# EasyEDA Pro project ProPrj_TTL2485_2025-05-29.epro

# Schematic Schematic1
Board Name: Board1; Create Date: 2025-05-03; Page Name: P1; Project Name: TTL2485; Schematic Name: Schematic1; Update Date: 2025-05-15; Company: 嘉立创EDA; Page Size: A4; Version: V1.0
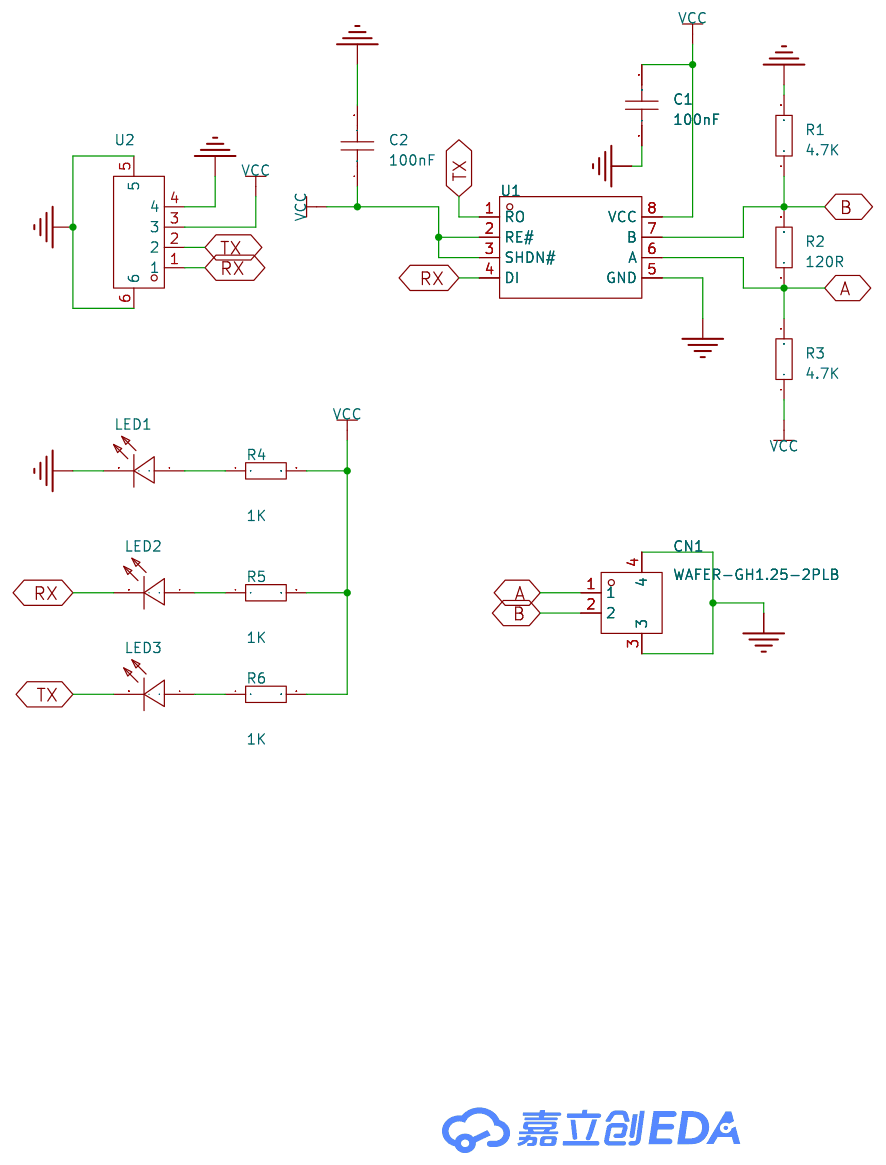
[diagram p0: schematic sheet]

## Parts
C1  100nF  [C0402]
C2  100nF  [C0402]
CN1  WAFER-GH1.25-2PLB  [CONN-TH_2P-P1.25_XUNPU_WAFER-GH1.25-2PLB]
LED1  PWR  [LED0603-R-RD]
LED2  RX  [LED0603-R-RD]
LED3  TX  [LED0603-R-RD]
R1  4.7K  [R0402]
R2  120R  [R0402]
R3  4.7K  [R0402]
R4  1K  [R0402]
R5  1K  [R0402]
R6  1K  [R0402]
U1  COS13488EESA  [SOP-8_L4.9-W3.9-P1.27-LS6.0-BL]
U2  WAFER-GH1.25-4PLB  [CONN-SMD_4P-P1.25_XUNPU_WAFER-GH1.25-4PLB]

## Library data of the parts
C1 C2 = CAP_0402: Supplier Footprint: 0402
CN1 = WAFER-GH1.25-2PLB: 插针结构:1x2P;间距:1.25mm;安装方式:立贴;参考系列:GH;总PIN数:2P;排数:1;每排PIN数:2;行距:-;额定电流:1A;触头材质:黄铜;触头镀层:-;工作温度:-25℃~+85℃;; LCSC Part Name: 1x2P 间距:1.25mm 立贴 系列:GH; Supplier Part: C3029368; Manufacturer: XUNPU(讯普); Supplier Footprint: SMD,P=1.25mm; JLCPCB Part Class: 扩展库; Datasheet: https://atta.szlcsc.com/upload/public/pdf/source/20220527/44F824AAC8C2B617205E15955FF9C23D.pdf; Supplier: LCSC; Pins Structure: 1x2P; Pitch: 1.25mm; Mounting Type: 立贴; Reference Series: GH; Number of Pins: 2P; Number of Rows: 1; Number of PINs Per Row: 2; Current Rating: 1A; Contact Material: 黄铜; Operating Temperature: -25℃~+85℃; Voltage Rating: 125V; Plastic Material: LCP; Supplementary Features: 辅助焊脚; Color: 米色; Z-Height of the Board: 4.2mm; X-Length of Bottom Edge on Board (Spacing Line): 5.75mm; Y-Width of Bottom Edge on Board: 4.95mm
LED1-LED3 = SZYY0603R: 发光颜色:红色;功率:40mW;正向电流:20mA;主波长:615nm~630nm;二极管配置:-;透镜颜色:无色透明透镜;色温:-;发光角度:120°;载带方式:-;工作温度:-40℃~+85℃;; LCSC Part Name: 红灯; Supplier Part: C434419; Manufacturer: yongyu(永裕光电); Supplier Footprint: 0603; JLCPCB Part Class: 扩展库; Datasheet: https://atta.szlcsc.com/upload/public/pdf/source/20191204/C434419_0B955C1F73FF88449D9A795B6FF49070.pdf; Supplier: LCSC; Emitted Color: 红色; Power Dissipation: 40mW; Forward Current: 20mA; Dominant Wavelength: 615nm~630nm; Peak Wavelength: 645nm; Lens Color: 无色透明透镜; Viewing Angle: 120°; Operating Temperature: -40℃~+85℃
R1-R6 = Res_0402: Supplier Footprint: 0402
U1 = COS13488EESA: 具有自动方向控制,省去隔离控制通道，16Mbps，RS-485/RS-422 半双工收发器; Supplier Part: C42381442; Manufacturer: COSINE(科山芯创); Supplier Footprint: SOP-8; Datasheet: https://atta.szlcsc.com/upload/public/pdf/source/20240710/2D3062658F0EC8CDE4998249F9B81B27.pdf; Supplier: LCSC
U2 = WAFER-GH1.25-4PLB: 插针结构:1x4P;间距:1.25mm;安装方式:立贴;参考系列:GH;总PIN数:4P;排数:1;每排PIN数:4;行距:-;额定电流:1A;触头材质:黄铜;触头镀层:-;工作温度范围:-25℃~+85℃;; LCSC Part Name: 1x4P 间距:1.25mm 立贴 系列:GH; Supplier Part: C3029370; Manufacturer: XUNPU(讯普); Supplier Footprint: SMD,P=1.25mm; JLCPCB Part Class: 扩展库; Datasheet: https://atta.szlcsc.com/upload/public/pdf/source/20220527/44F824AAC8C2B617205E15955FF9C23D.pdf; Supplier: LCSC; Pins Structure: 1x4P; Pitch: 1.25mm; Mounting Type: 立贴; Reference Series: GH; Number of Pins: 4P; Number of Rows: 1; Number of PINs Per Row: 4; Current Rating: 1A; Contact Material: 黄铜; Operating Temperature: -25℃~+85℃; Voltage Rating: 125V; Plastic Material: LCP; Supplementary Features: 辅助焊脚; Color: 米色; Z-Height of the Board: 4.2mm; X-Length of Bottom Edge on Board (Spacing Line): 8.25mm; Y-Width of Bottom Edge on Board: 4.95mm

## Nets
GND: C1.1 C2.2 CN1.3 CN1.4 LED1.2(-) R1.2 U1.5(GND) U2.4 U2.5 U2.6
VCC: C1.2 C2.1 R3.1 R4.2 R5.2 R6.2 U1.2(RE#) U1.3(SHDN#) U1.8(VCC) U2.3
A: CN1.1 R2.1 R3.2 U1.6(A)
B: CN1.2 R1.1 R2.2 U1.7(B)
RX: LED2.2(-) U1.4(DI) U2.1
TX: LED3.2(-) U1.1(RO) U2.2
$1N1480: LED1.1(+) R4.1
$1N1639: LED2.1(+) R5.1
$1N1644: LED3.1(+) R6.1

# Board PCB1
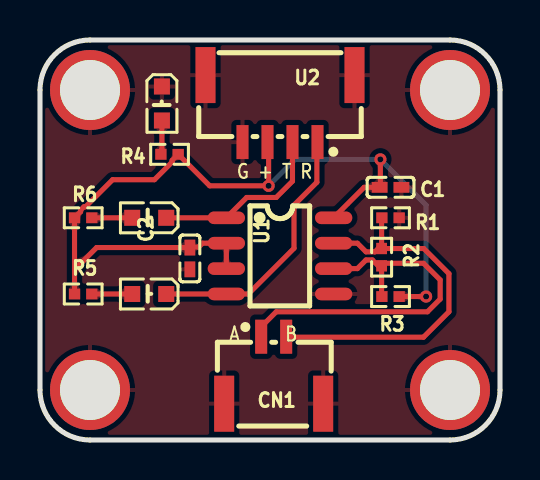
[diagram p1: board, top side]
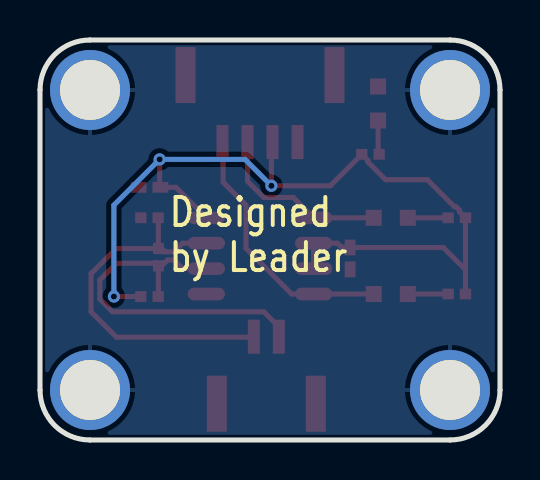
[diagram p2: board, bottom side, seen from below]

Outline 23 x 20 mm; copper layers: Top Layer, Bottom Layer. Coordinates in mm from the lower left corner of the outline.
Outline path: 0,17.5 0,2.5 arc(0.73,0.73) 2.5,0 20.5,0 arc(22.27,0.73) 23,2.5 23,17.5 arc(22.27,19.27) 20.5,20 2.5,20 arc(0.73,19.27) 0,17.5
Stack: Top Layer 0.035mm / Dielectric1 1.51mm FR4 er 4.5 / Bottom Layer 0.035mm

## Design rules (mm)
net A: RS485
net B: RS485
template: JLCPCB Capability(Two Layers Board)
spacing copperThickness1oz (default): track to track 0.102, other pairs 0.152 to 0.3
spacing copperThickness2oz: track to track 0.203, other pairs 0.152 to 0.3
track width copperThickness1oz (default): min 0.127, default 0.254, max 2.54
track width copperThickness2oz: min 0.203, default 0.254, max 2.54
differential pair differentialPair (default): width min 0.127, default 0.254, max 2.54; gap min 0.152, default 0.152
via viaSize (default): diameter min 0.5, default 0.61, max 10; hole min 0.3, default 0.305, max 6.3

## Placement (name value [footprint] x y rotation side)
C1  100nF  [C0402]  17.53 12.63 180 top
C2  100nF  [C0402]  7.49 9.08 270 top
CN1  WAFER-GH1.25-2PLB  [CONN-TH_2P-P1.25_XUNPU_WAFER-GH1.25-2PLB]  11.68 3.49 0 top
LED1  PWR  [LED0603-R-RD]  6.1 16.83 270 top
LED2  RX  [LED0603-R-RD]  5.46 7.3 180 top
LED3  TX  [LED0603-R-RD]  5.46 11.11 180 top
NOREF  -  [Pad_e20]  20.5 17.5 0 top
NOREF#2  -  [Pad_e16]  2.5 2.5 0 top
NOREF#3  -  [Pad_e13]  2.5 17.5 0 top
NOREF#4  -  [Pad_e19]  20.5 2.5 0 top
R1  4.7K  [R0402]  17.53 11.11 0 top
R2  120R  [R0402]  17.08 9.14 90 top
R3  4.7K  [R0402]  17.53 7.17 180 top
R4  1K  [R0402]  6.48 14.28 0 top
R5  1K  [R0402]  2.16 7.3 180 top
R6  1K  [R0402]  2.16 11.11 180 top
U1  COS13488EESA  [SOP-8_L4.9-W3.9-P1.27-LS6.0-BL]  12 9.2 270 top
U2  WAFER-GH1.25-4PLB  [CONN-SMD_4P-P1.25_XUNPU_WAFER-GH1.25-4PLB]  12 16.57 180 top

## Footprints (pads in the part's own frame, mm; a bottom-side part is the same pattern mirrored in y, then rotated)
C0402
  rect 0.79x0.54 smd: 1(-0.545,0) 2(0.545,0)
CONN-SMD_4P-P1.25_XUNPU_WAFER-GH1.25-4PLB
  rect 0.6x1.7 smd: 1(-1.875,1.675) 2(-0.625,1.675) 3(0.625,1.675) 4(1.875,1.675)
  rect 1x2.8 smd: 5(-3.725,-1.675) 6(3.725,-1.675)
CONN-TH_2P-P1.25_XUNPU_WAFER-GH1.25-2PLB
  rect 0.6x1.7 smd: 1(-0.625,1.675) 2(0.625,1.675)
  rect 1x2.8 smd: 3(2.475,-1.675) 4(-2.475,-1.675)
LED0603-R-RD
  rect 0.8x0.8 smd: 1(0.851,0) 2(-0.851,0)
Pad_e13
  round 4 hole 3: 1(0,0)
Pad_e16
  round 4 hole 3: 1(0,0)
Pad_e19
  round 4 hole 3: 1(0,0)
Pad_e20
  round 4 hole 3: 2(0,0)
R0402
  rect 0.566x0.54 smd: 1(-0.433,0) 2(0.433,0)
SOP-8_L4.9-W3.9-P1.27-LS6.0-BL
  oval 0.63x1.865 smd: 1(-1.905,-2.683) 2(-0.635,-2.683) 3(0.635,-2.683) 4(1.905,-2.683) 5(1.905,2.683) 6(0.635,2.683) 7(-0.635,2.683) 8(-1.905,2.683)

## Nets
As in the schematic, except:
GND: C1.1 C2.2 CN1.3 CN1.4 LED1.2 NOREF.2 NOREF#2.1 NOREF#3.1 NOREF#4.1 R1.2 U1.5 U2.4 U2.5 U2.6

## Via types
v1: diameter 0.61, hole 0.305, Top Layer to Bottom Layer, 3 vias

## Routing (per net, layer and track width the routed paths; a pad name or vN(x,y) marks a point on that pad's centre or on a via; arc(x,y) is an arc through that point)
VCC: length 46.8
  Top Layer w0.254: 7.5,9.65 7.93,9.65 8.13,9.84 U1.2 U1.3 ; C2.1 2.83,9.62 1.73,8.52 ; 1.73,8.52 R5.2 ; 1.73,8.52 R6.2 2.03,11.41 2.03,11.5 2.19,11.66 2.28,11.66 3.63,13.02 5.72,13.02 6.61,13.9 6.61,13.98 R4.2 8.49,12.71 v1(11.43,12.71) 11.43,14.84 U2.3 ; U1.8 16.21,12.63 16.98,12.63 17.02,12.67 v1(17.02,14.03) ; R3.1 v1(19.3,7.17)
  Bottom Layer w0.254: v1(11.43,12.71) 12.75,14.03 v1(17.02,14.03) 19.3,11.75 v1(19.3,7.17)
A: length 18.7
  Top Layer w0.254: R2.1 17.21,8.84 19.18,8.84 20.01,8 20.01,7.05 19.37,6.41 11.81,6.41 11.06,5.66 11.06,5.04 ; R2.1 16.91,8.71 16.62,9 16.3,9 15.87,8.57 U1.6 ; R2.1 17.08,7.19 17.09,7.17
B: length 18.7
  Top Layer w0.254: 17.09,11.11 17.08,11.1 R2.2 ; U1.7 15.87,9.84 16.3,9.41 16.75,9.41 16.91,9.57 R2.2 ; R2.2 19.19,9.57 20.45,8.32 20.45,6.41 19.18,5.14 12.33,5.14 CN1.2 ; 12.31,5.04 12.33,5.01
RX: length 13.1
  Top Layer w0.254: U2.1 13.84,14.86 13.84,12.89 12.7,11.75 12.7,9.59 10.41,7.3 U1.4 LED2.2
TX: length 9
  Top Layer w0.254: U2.2 12.62,12.94 11.81,12.13 10.33,12.13 U1.1 LED3.2
$1N1480: length 1.7
  Top Layer w0.254: LED1.1 6.1,14.52 6.09,14.52 6.09,14.33 R4.1
$1N1639: length 2
  Top Layer w0.254: R5.1 LED2.1
$1N1644: length 2
  Top Layer w0.254: R6.1 LED3.1

## Copper pours and planes (outline as drawn; the poured copper is in the pictures)
GND on Top Layer: -2.16,22.67 26.29,22.67 26.29,-11.88 -2.16,-11.88
GND on Bottom Layer: -5.33,23.94 29.34,23.94 29.34,-16.32 -5.33,-16.32

Small or netless copper shapes (teardrops, artwork), in the pictures only: 24 on Top Layer, 2 on Bottom Layer

## Text on the board
Bottom Silkscreen Layer: Designed / by Leader
Top Silkscreen Layer: A     B | G + T R
